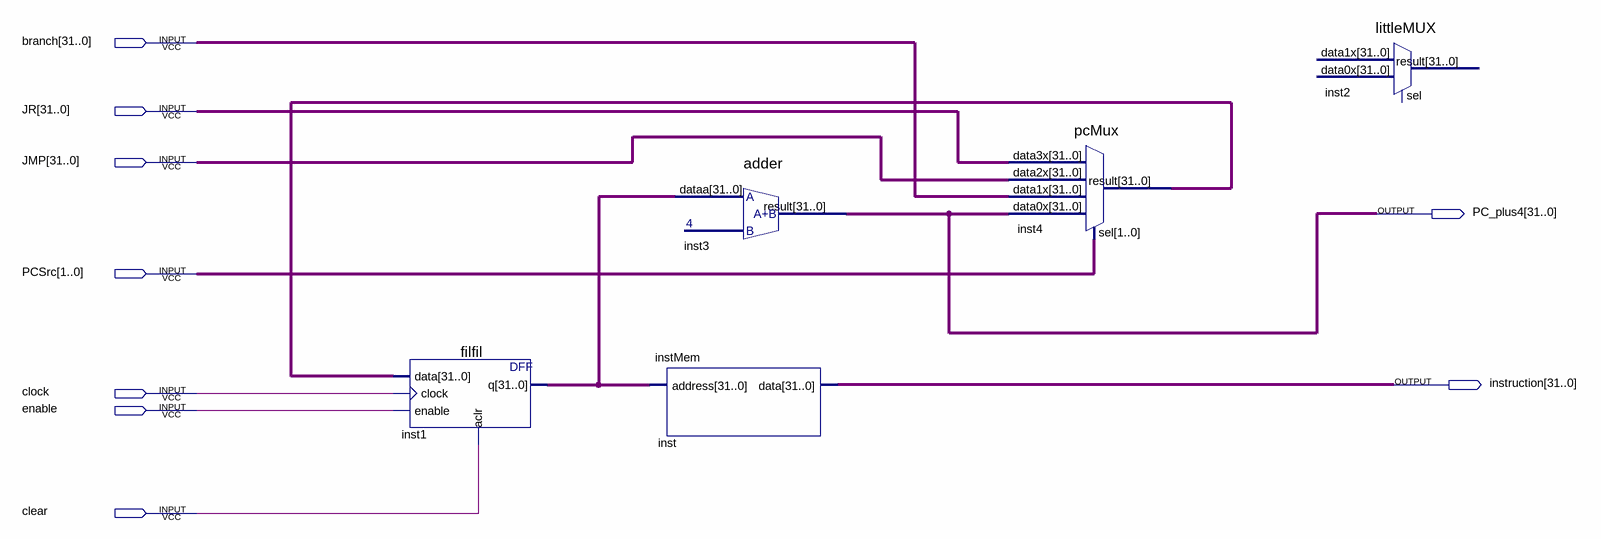
[diagram p0: schematic sheet]
// Quartus schematic instFetchLEVEL.bdf as structural Verilog: 5 symbols, 9 pins
module instFetchLEVEL (
  input  [31:0] branch,
  input  [31:0] JR,
  input  [31:0] JMP,
  input  [1:0] PCSrc,
  input  clock,
  input  enable,
  input  clear,
  output [31:0] PC_plus4,
  output [31:0] instruction
);

  wire [31:0] inst1_q, inst4_result;

  filfil inst1 (.data(inst4_result), .clock(clock), .enable(enable), .aclr(clear), .q(inst1_q));
  instMem inst (.address(inst1_q), .data(instruction));
  adder inst3 (.dataa(inst1_q), .result(PC_plus4));
  pcMux inst4 (.data3x(JR), .data2x(JMP), .data1x(branch), .data0x(PC_plus4), .sel(PCSrc), .result(inst4_result));
  littleMUX inst2 ();  // open: data1x, data0x, sel, result
endmodule
